# Altium project Parkinsonstester.PrjPcb
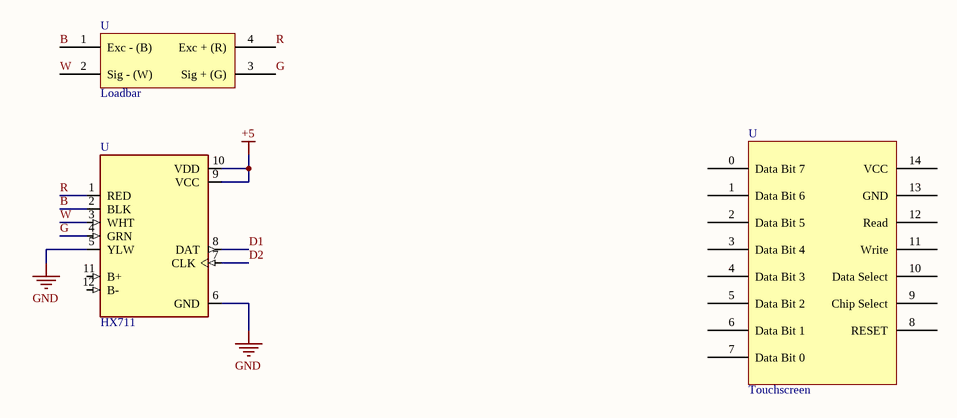
[diagram p0: Prototype.SchDoc]
1 sheet, 3 parts. Net scope: global (net labels, ports and power ports of the same name join across sheets).

## Sheet Prototype.SchDoc
size A4; SheetNumber: 1; SheetTotal: 1

### Parts
(Parts that share a designator on the sheet are numbered #1, #2 ... from top to bottom, then left to right.)
U#1  Loadbar
U#2  HX711  [SPARKFUN_SEN-13879]
U#3  Touchscreen

### Nets
+5: U#2.9(VCC) U#2.10(VDD)
GND: U#2.5(YLW) U#2.6(GND)
B: U#1.1(Exc_-_(B)) U#2.2(BLK)
D1: U#2.8(DAT)
D2: U#2.7(CLK)
G: U#1.3(Sig_+_(G)) U#2.4(GRN)
R: U#1.4(Exc_+_(R)) U#2.1(RED)
W: U#1.2(Sig_-_(W)) U#2.3(WHT)

Not connected (* = marked no-connect by the designer): U#2 11(B+) 12(B-); U#3 0(Data_Bit_7) 1(Data_Bit_6) 2(Data_Bit_5) 3(Data_Bit_4) 4(Data_Bit_3) 5(Data_Bit_2) 6(Data_Bit_1) 7(Data_Bit_0) 8(RESET) 9(Chip_Select) 10(Data_Select) 11(Write) 12(Read) 13(GND) 14(VCC)

### Library data of the parts
U#2 = HX711: External Input Sensor Amplifier; MP: SEN-13879; MF: SparkFun; Package: None; Price: None; Availability: Unavailable; Value: *; SnapEDA_Link: https://www.snapeda.com/parts/SEN-13879/SparkFun%20Electronics/view-part/563337/?ref=snap